# EAGLE design GVS1.1 (EAGLE 7.0.0)
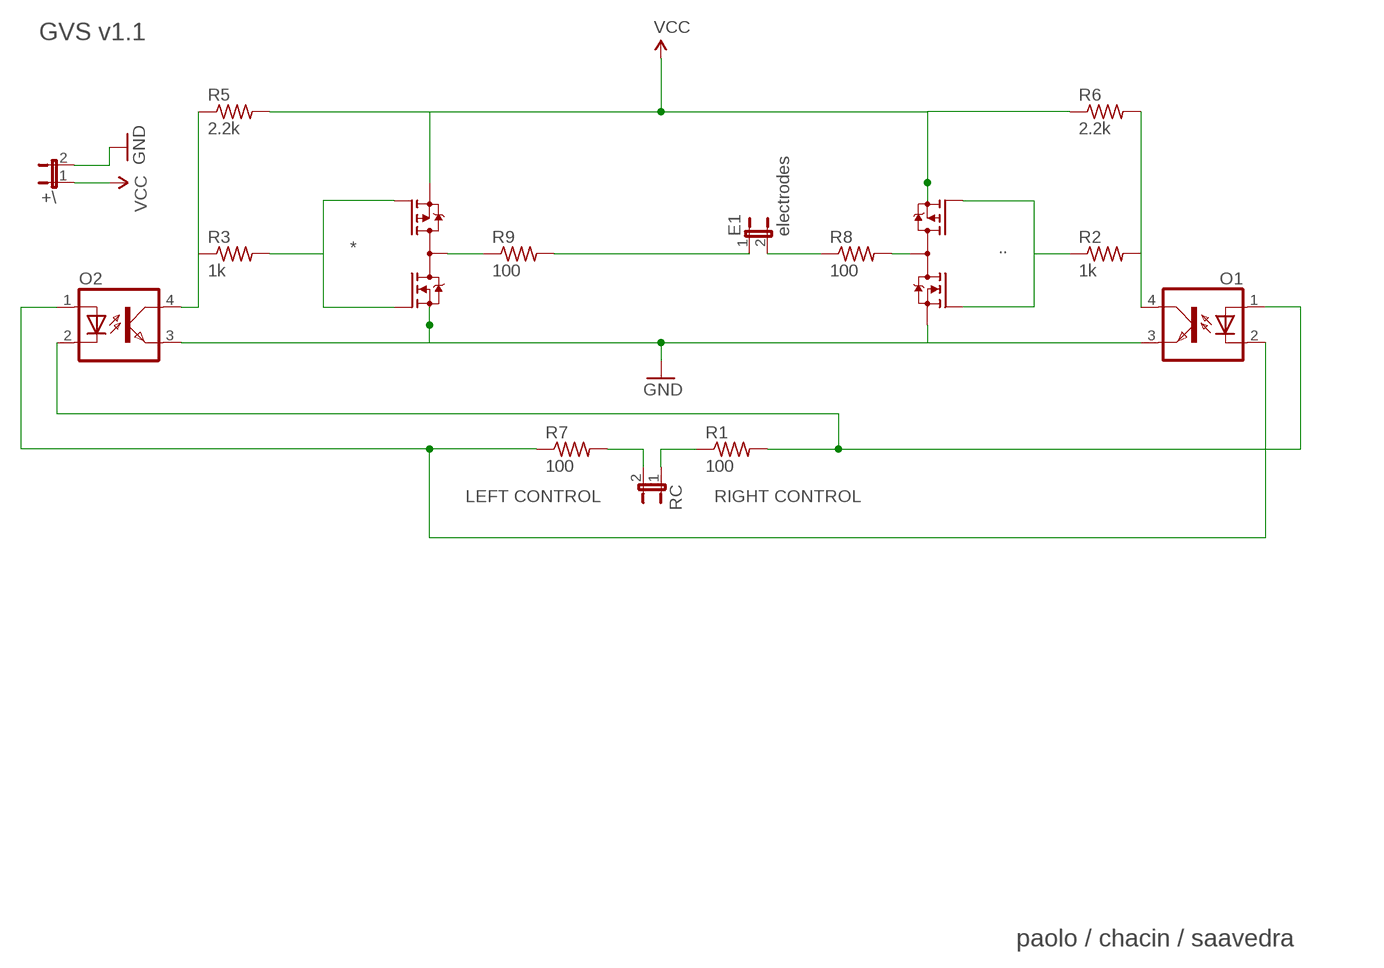
[diagram p0: schematic, sheet 1]

## Parts
*  IRF7389  [SO08-IRF]
+\  JP1E  [JP1]
..  IRF7389  [SO08-IRF]
E1  electrodes  JP1E  [JP1]
O1  SFH618A-2  [DIP4]
O2  SFH618A-2  [DIP4]
R1  100  R-US_FLIPFLOP7  [0805-THM-7]
R2  1k  R-US_FLIPFLOP7  [0805-THM-7]
R3  1k  R-US_FLIPFLOP7  [0805-THM-7]
R5  2.2k  R-US_FLIPFLOP7  [0805-THM-7]
R6  2.2k  R-US_FLIPFLOP7  [0805-THM-7]
R7  100  R-US_FLIPFLOP7  [0805-THM-7]
R8  100  R-US_FLIPFLOP7  [0805-THM-7]
R9  100  R-US_FLIPFLOP7  [0805-THM-7]
RC  JP1E  [JP1]

## Nets
+: *.3(P-S) +\.1 ...3(P-S) R5.2 R6.1 ; supply symbol labelled VCC
GND: *.1(N-S) +\.2 ...1(N-S) O1.3(EMIT) O2.3(EMIT)
N$1: O2.4(COL) R3.1 R5.1
N$2: ...5(D) ...6(D) ...7(D) ...8(D) R8.2
N$3: *.5(D) *.6(D) *.7(D) *.8(D) R9.1
N$4: E1.1 R9.2
N$6: E1.2 R8.1
N$7: ...2(N-G) ...4(P-G) R2.1
N$8: O1.4(COL) R2.2 R6.2
N$9: *.2(N-G) *.4(P-G) R3.2
N$10: R7.2 RC.2
N$11: R1.1 RC.1
N$12: O1.2(C) O2.1(A) R7.1
N$13: O1.1(A) O2.2(C) R1.2

## Notes on the sheet
- GVS v1.1
- LEFT CONTROL | RIGHT CONTROL
- paolo / chacin / saavedra

## Library data of the parts
* .. = transistor-fet:IRF7389: Complimentary Half Bridge HEXFET Power MOSFET Source: http://www.irf.com/product-info/datasheets/data/irf7389.pdf
+\ E1 RC = jumper:JP1E: JUMPER
O1 O2 = optocoupler:SFH618?*: Optocoupler, Phototransistor Output, Low Input Current Source: http://www.vishay.com/docs/83673/sfh618.pdf; MF: VISHAY/TELEFUNKEN; MPN: SFH618A-2; OC_FARNELL: 6424855; OC_NEWARK: 21H7744
R1-R3 R5-R9 = adafruit:R-US_: RESISTOR, American symbol

## Board
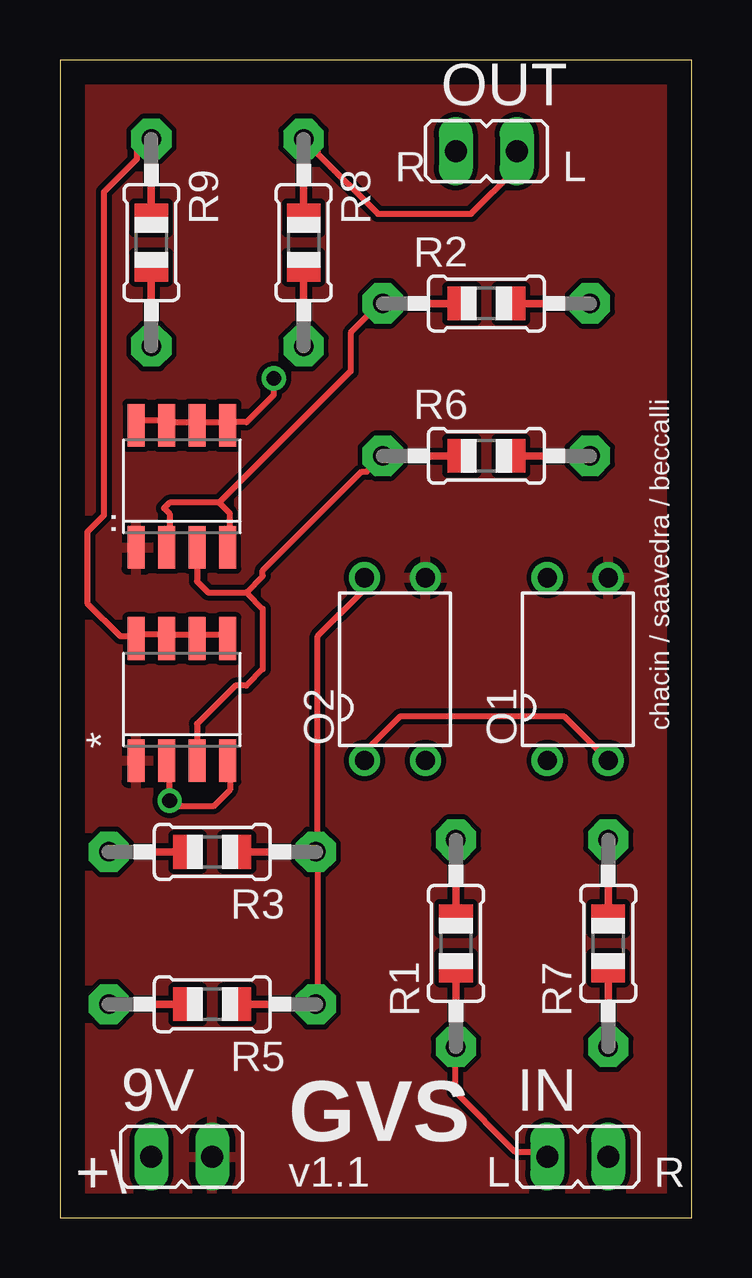
[diagram p1: board, top side]
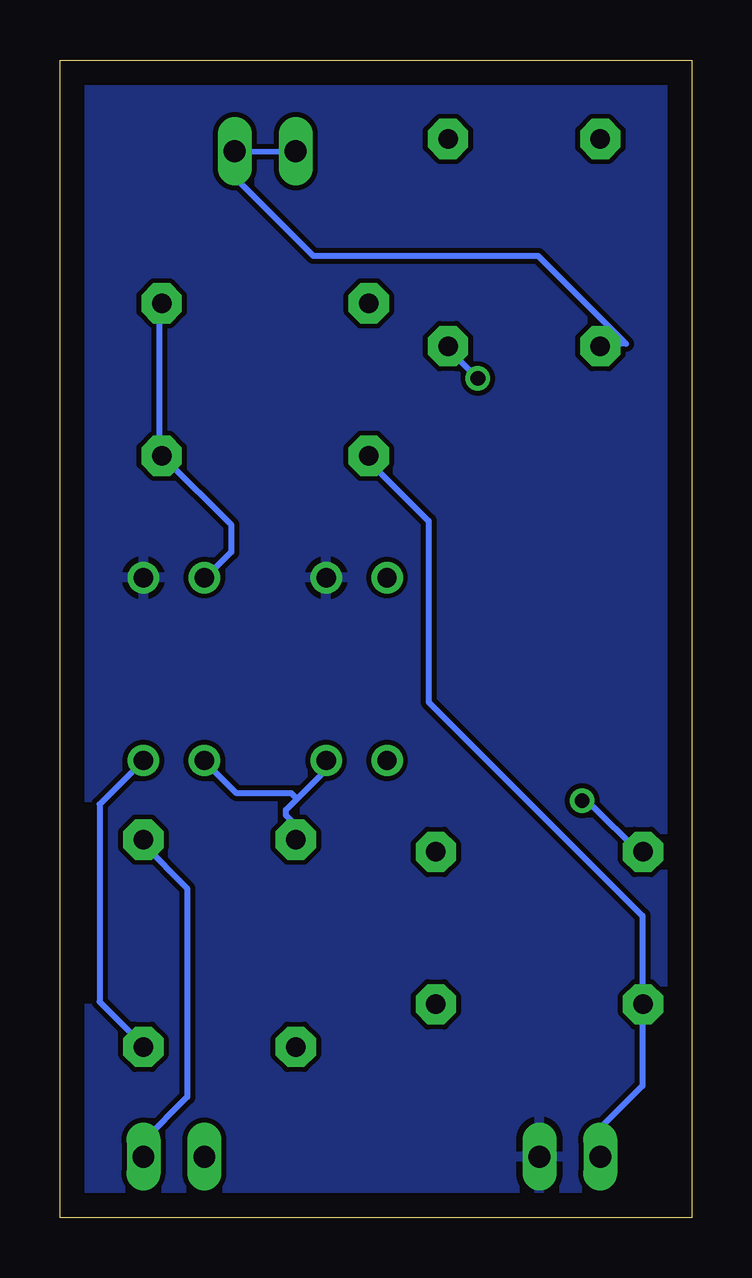
[diagram p2: board, bottom side, seen from below]

Size 26.34 x 48.25 mm. Coordinates in mm from the lower left corner, seen from the top.
Outline: 0,0 26.34,0 26.34,48.25 0,48.25 0,0
Copper layers (1*16): Top 0.035mm / dielectric 1.5mm / Bottom 0.035mm
Design rules "default": minimum track width 10mil, minimum drill 24mil, track to track 8mil, track to pad 8mil, pad to pad 8mil, via to via 8mil, smd to smd 8mil, copper to edge 40mil, drill to drill 8mil, minimum pad ring 10mil, minimum via ring 8mil, stop-mask expansion 4mil, vias tented up to drill 0mil, thermal gap 10mil

### Footprints (pad centres in the part's own frame; a part is rotated, then mirrored left to right if it is on the bottom)
SO08-IRF = smd 0.72 x 1.78: 1 -1.905,-2.543; 2 -0.635,-2.543; 3 0.635,-2.543; 4 1.905,-2.543; 5 1.905,2.543; 6 0.635,2.543; 7 -0.635,2.543; 8 -1.905,2.543
JP1 = drill 0.914 long: 1 0,-1.27; 2 0,1.27
DIP4 = drill 0.8: 1 -1.27,-3.81; 2 1.27,-3.81; 3 1.27,3.81; 4 -1.27,3.81
0805-THM-7 = drill 0.813 pad 1.676 octagon: 1 -4.318,0; 2 4.318,0

### Placement (x,y rotation side)
*  5.08,21.59 0 top
+\  5.08,2.54 270 top
..  5.08,30.48 0 top
E1  17.78,44.45 270 top
O1  21.59,22.86 0 top
O2  13.97,22.86 0 top
R1  16.51,11.43 90 top
R2  17.78,38.1 0 top
R3  6.35,15.24 180 top
R5  6.35,8.89 180 top
R6  17.78,31.75 0 top
R7  22.86,11.43 90 top
R8  10.16,40.64 270 top
R9  3.81,40.64 270 top
RC  21.59,2.54 270 top

### Tracks (layer width: path | path; a pad name or v marks a point on that pad's centre or on a via)
+
  Top 0.254: *.3 5.71,20.57 7.32,22.17 7.77,22.17 8.46,22.86 8.46,25.38 7.77,26.06 | 7.77,26.06 6.17,26.06 5.71,26.52 ...3 | R6.1 12.8,31.09 12.57,31.09 8.46,26.98 8.46,26.75 7.77,26.06
  Bottom 0.254: +\.1 3.66,2.74 3.66,3.89 2.06,5.49 2.06,8.69 R5.2 2.06,8.91 2.06,12.57 10.97,21.49 10.97,29.03 13.49,31.55 R6.1
GND
  pour Bottom: -2.54,52.07 -2.54,-1.27 31.75,-1.27 31.75,52.07
  pour Top: 29.21,49.53 -3.81,49.53 -3.81,-2.54 29.21,-2.54
N$1
  Top 0.254: O2.4 12.57,26.52 12.57,26.06 10.74,24.23 10.74,15.32 R3.1 10.74,15.09 10.74,8.91 R5.1
N$2  (via drill 0.61)
  Top 0.254: ...8 3.2,33.22 4.34,33.22 ...7 4.57,33.15 5.71,33.15 | 5.71,33.15 6.86,33.15 ...5 7.09,33.15 7.77,33.15 8.91,34.29 v8.91,34.98 | 5.71,33.15 ...6
  Bottom 0.254: v8.91,34.98 10.06,36.12 R8.2
N$3
  Top 0.254: 5.71,24.31 4.57,24.31 *.7 4.34,24.31 3.2,24.31 *.8 2.97,24.23 2.52,24.23 1.14,25.6 1.14,28.57 1.83,29.26 1.83,42.75 3.2,44.12 3.2,44.58 3.66,45.03 R9.1 | 5.71,24.31 6.86,24.31 *.5 | 5.71,24.31 *.6
N$4
  Bottom 0.254: E1.1 18.97,44.42 18.97,43.28 15.77,40.08 6.4,40.08 2.74,36.42 R9.2
N$6
  Top 0.254: E1.2 18.97,44.35 18.97,43.66 17.14,41.83 13.26,41.83 10.74,44.35 10.74,44.58 10.29,45.03 R8.1
N$7
  Top 0.254: 6.63,29.79 4.57,29.79 4.34,29.57 4.57,29.34 4.57,27.96 ...2 | 6.63,29.79 7.09,29.34 7.09,27.96 ...4 | 6.63,29.79 12.12,35.28 12.12,36.88 13.26,38.02 R2.1
N$8
  Bottom 0.254: O1.4 20.12,26.82 19.2,27.74 19.2,28.88 21.95,31.62 R6.2 22.17,31.85 22.17,38.02 R2.2
N$9  (via drill 0.61)
  Top 0.254: *.2 4.57,18.97 v4.57,17.37 4.8,17.14 6.4,17.14 7.09,17.83 7.09,18.97 *.4
  Bottom 0.254: v4.57,17.37 4.34,17.37 2.06,15.09 R3.2
N$10
  Bottom 0.254: RC.2 22.86,3.2 21.03,5.03 21.03,13.72 22.86,15.54 R7.2
N$11
  Top 0.254: RC.1 20.12,2.74 18.97,2.74 16.46,5.26 16.46,7.09 R1.1
N$12
  Top 0.254: O1.2 21.03,20.88 14.17,20.88 12.8,19.51 12.8,19.05 O2.1
  Bottom 0.254: O1.2 24.69,17.22 24.69,8.99 22.86,7.16 R7.1
N$13
  Bottom 0.254: 16.46,17.45 16.92,16.99 16.92,16.76 16.69,16.54 16.69,15.85 R1.2 | 16.46,17.45 15.32,18.59 15.32,19.05 O2.2 | 16.46,17.45 16.69,17.68 18.97,17.68 20.12,18.82 20.12,19.05 O1.1

### Text on the board
tNames: OUT | R | L | chacin / saavedra / beccalli | 9V | IN | GVS | v1.1 | L | R